# Altium schematic sheet Power_Management.SchDoc
size A4; SheetNumber: 4; SheetTotal: 7
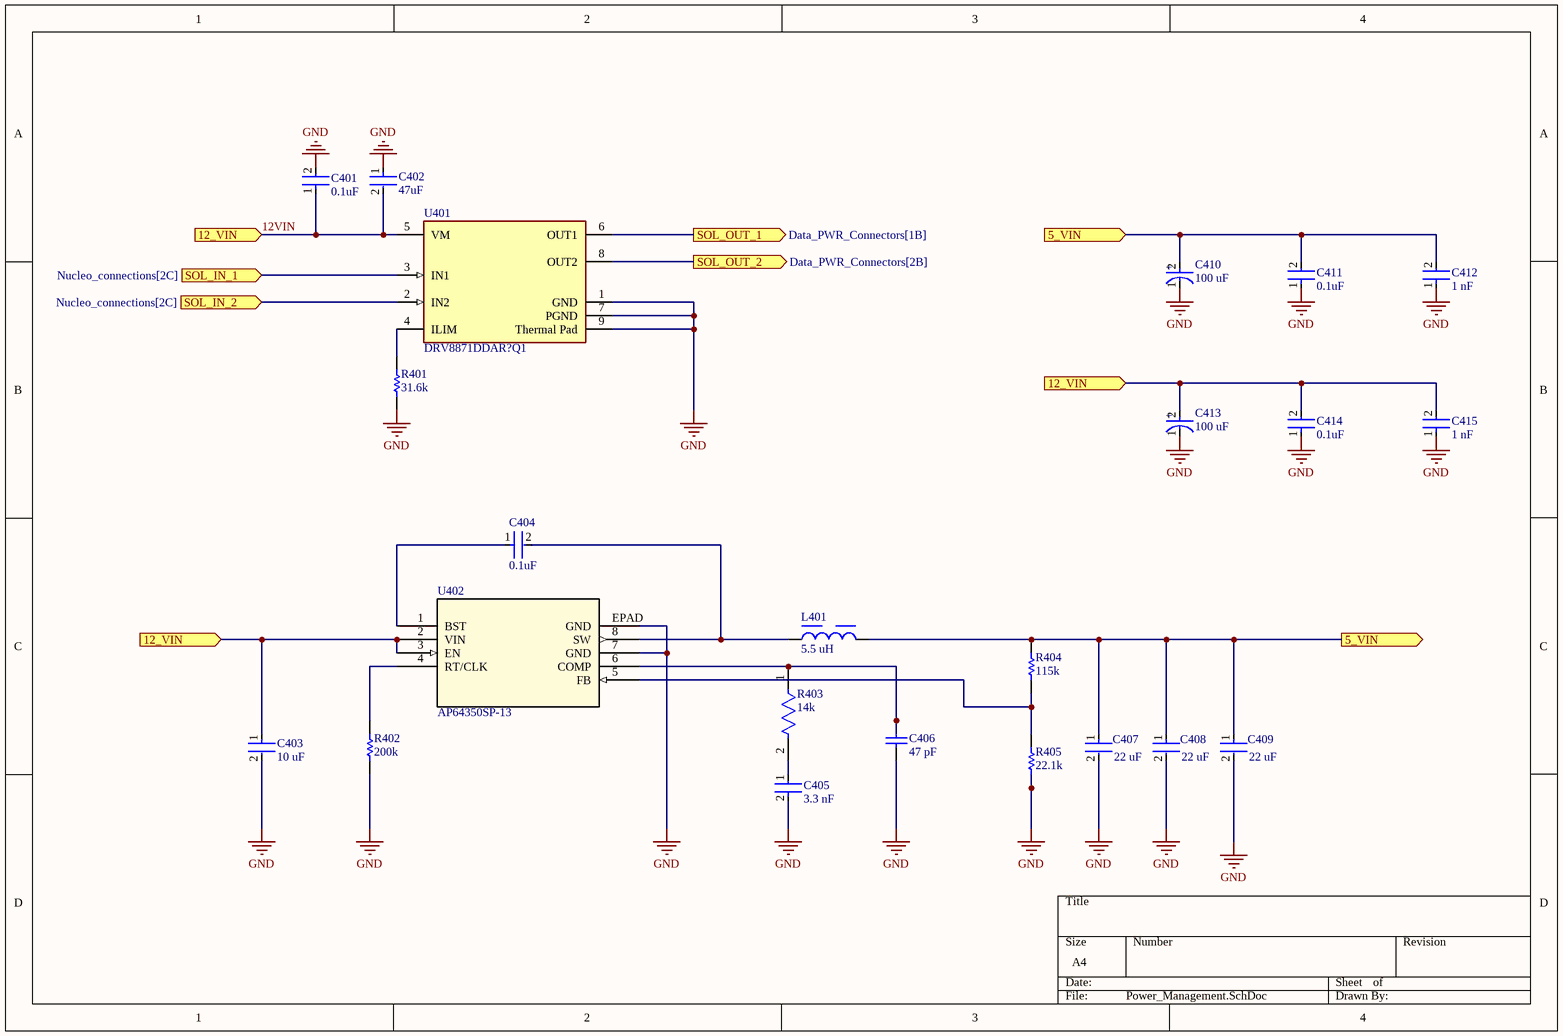
[diagram p0: Power_Management.SchDoc]

## Parts
C401  0.1uF  [FP-0805-L_2_01_0_2-W_1_25-IPC_B]
C402  47uF  [FP-C0805C476M9PACTU-MFG]
C403  10 uF  [FP-GRM21B-0_1-IPC_C]
C404  0.1uF  [FP-0805-L_2_01_0_2-W_1_25-IPC_B]
C405  3.3 nF  [FP-GRM216-0_1-IPC_B]
C406  47 pF  [CAPC2013X135X50NL15T20]
C407  22 uF  [FP-GRM21B-0_15-MFG]
C408  22 uF  [FP-GRM21B-0_15-MFG]
C409  22 uF  [FP-GRM21B-0_15-MFG]
C410  100 uF  [FP-RAD-TH-D_6_3_0_5-L_11-MFG]
C411  0.1uF  [FP-0805-L_2_01_0_2-W_1_25-IPC_B]
C412  1 nF  [FP-0805-L_2_01_0_2-W_1_25-IPC_C]
C413  100 uF  [FP-RAD-TH-D_6_3_0_5-L_11-MFG]
C414  0.1uF  [FP-0805-L_2_01_0_2-W_1_25-IPC_B]
C415  1 nF  [FP-0805-L_2_01_0_2-W_1_25-IPC_C]
L401  5.5 uH  [WE-HCI_1050]
R401  31.6k  [RESC2013X70X40LL20T20]
R402  200k  [RESC2013X70X40LL20T20]
R403  14k  [FP-CRCW0805-e3-MFG]
R404  115k  [RESC2013X50X30LL20T20]
R405  22.1k  [RESC2013X70X40NL20T20]
U401  DRV8871DDAR?Q1  [FP-DDA0008E-IPC_B]
U402  AP64350SP-13  [SO-8EP_DIO]

## Ports
5_VIN (in, see General_Tranceivers[2B], Nucleo_connections[2A], Power_Management[4C], SERVO_CAN[1B]), 5_VIN (out, see General_Tranceivers[2B], Nucleo_connections[2A], Power_Management[3A], SERVO_CAN[1B]), 12_VIN (in, see Data_PWR_Connectors[1B], Data_PWR_Connectors[4B], Power_Management[1A], Power_Management[1C], Protection_Circuit[4B], Switching_Circuits[3B], Switching_Circuits[3C], Switching_Circuits[6B], Switching_Circuits[6C]), 12_VIN (in, see Data_PWR_Connectors[1B], Data_PWR_Connectors[4B], Power_Management[1A], Power_Management[3B], Protection_Circuit[4B], Switching_Circuits[3B], Switching_Circuits[3C], Switching_Circuits[6B], Switching_Circuits[6C]), 12_VIN (in, see Data_PWR_Connectors[1B], Data_PWR_Connectors[4B], Power_Management[1C], Power_Management[3B], Protection_Circuit[4B], Switching_Circuits[3B], Switching_Circuits[3C], Switching_Circuits[6B], Switching_Circuits[6C]), SOL_IN_1 (in, see Nucleo_connections[2C]), SOL_IN_2 (in, see Nucleo_connections[2C]), SOL_OUT_1 (out, see Data_PWR_Connectors[1B]), SOL_OUT_2 (out, see Data_PWR_Connectors[2B])

## Nets
GND: C401.2 C402.1 C403.2 C405.2 C406.1 C407.2 C408.2 C409.2 C410.1(C) C411.1 C412.1 C413.1(C) C414.1 C415.1 R401.1 R402.1 R405.1 U401.1(GND) U401.7(PGND) U401.9(Thermal_Pad) U402.7(GND) U402.EPAD(GND)
5_VIN: C407.1 C408.1 C409.1 C410.2(A) C411.2 C412.2 L401.2 R404.2 ; port 5_VIN
12VIN: C401.1 C402.2 C403.1 C413.2(A) C414.2 C415.2 U401.5(VM) U402.2(VIN) U402.3(EN) ; port 12_VIN
SOL_IN_1: U401.3(IN1) ; port SOL_IN_1
SOL_IN_2: U401.2(IN2) ; port SOL_IN_2
SOL_OUT_1: U401.6(OUT1) ; port SOL_OUT_1
SOL_OUT_2: U401.8(OUT2) ; port SOL_OUT_2
NetC404_1: C404.1 U402.1(BST)
NetC404_2: C404.2 L401.1 U402.8(SW)
NetC405_1: C405.1 R403.2
NetC406_2: C406.2 R403.1 U402.6(COMP)
NetR401_2: R401.2 U401.4(ILIM)
NetR402_2: R402.2 U402.4(RT/CLK)
NetR404_1: R404.1 R405.2 U402.5(FB)

## Notes on the sheet
- (in symbol CMP-05427-000897-1) +

## Library data of the parts
C401 C404 C411 C414 = CMP-2007-04172-2: Automotive Ceramic Capacitor, 0805, 100nF, 10%, X7R, 15%, 100V; Voltage Rating (DC): 100V; Case Code (Metric): 2012; Mount: Surface Mount; Length: 2.01mm; Depth: 1.25mm; Lead Free: Lead Free; Ratings: AEC-Q200; Max Operating Temperature: 125°C; Tolerance: 10%; Case/Package: 0805; Width: 0.049inch; Package Quantity: 1; Thickness: 0.055inch; Construction: Flat; Min Operating Temperature: -55°C; REACH SVHC: No SVHC; Number of Pins: 2; Radiation Hardening: No; Capacitance: 100nF; Voltage Rating: 100V; Height: 1.4mm; Series: -; Voltage: 100V; Dielectric: X7R; Termination: SMD/SMT; Case Code (Imperial): 0805; RoHS Compliant: Yes; Packaging: Tape and Reel; Dielectric Material: Ceramic
C402 = CMP-2007-01008-2: CAP CER 47UF 6.3V X5R 0805; Dielectric Material: Ceramic; Dissipation Factor: 5%; Tolerance: 20%; Case Code (Imperial): 0805; Mount: PCB; Width: 1.2mm; Package Quantity: 3000; Radiation Hardening: No; Packaging: Tape and Reel; Termination: SMD/SMT; Series: C0805C; Voltage: 6.3V; Depth: 1.25mm; Dielectric: X5R; Case Code (Metric): 2012; Length: 2mm; Case/Package: 0805; REACH SVHC: No SVHC; Voltage Rating (DC): 6.3V; Capacitance: 47uF; RoHS Compliant: Yes; Height: 1.25mm; Construction: Flat; Number of Pins: 2; Voltage Rating: 6.3V; Max Operating Temperature: 85°C; Min Operating Temperature: -55°C
C403 = CMP-2007-03453-2: Chip Multilayer Ceramic Capacitors for General Purpose, 0805, 10uF, X5R, 15%, 10%, 16V; Radiation Hardening: No; Thickness: 0.053inch; Voltage Rating (DC): 16V; Lead Free: Lead Free; Package Quantity: 1; Width: 1.25mm; Case Code (Imperial): 0805; Depth: 1.25mm; Packaging: Tape and Reel; Dielectric: X5R; Max Operating Temperature: 85°C; Tolerance: 10%; Voltage Rating: 16V; Voltage: 16V; Capacitance: 10uF; Height: 1.25mm; Case Code (Metric): 2012; Material: Ceramic; Mount: Surface Mount; Case/Package: 0805; REACH SVHC: No SVHC; Length: 2mm; Min Operating Temperature: -55°C; Termination: SMD/SMT
C405 = CMP-2007-00889-2: Chip Multilayer Ceramic Capacitors for General Purpose, 0805, 3300pF, C0G, 30ppm/°C, 5%, 50V; Insulation Resistance: 10GR; Capacitance: 3.3nF; Mount: Surface Mount; Case/Package: 0805; Case Code (Imperial): 0805; Lead Free: Lead Free; RoHS Compliant: Yes; Dielectric: C0G; Material: Ceramic; Size: 0.6mm; Voltage Rating (DC): 50V; Voltage: 50V; Termination: SMD/SMT; Case Code (Metric): 2012; Construction: Flat; Max Operating Temperature: 125°C; Series: GRM; Min Operating Temperature: -55°C; Temperature Coefficient: 30ppm/°C; Packaging: Tape and Reel; Height: 0.6mm; REACH SVHC: No SVHC; Width: 0.049inch; Length: 2mm; Thickness: 0.028inch; Voltage Rating: 50V; Tolerance: 5%; Number of Pins: 2; Package Quantity: 1; Dielectric Material: Ceramic; Depth: 1.25mm
C406 = CMP-1036-01617-2: Part Number: VJ0805A470JXACW1BC; Manufacturer: Vitramon
C407-C409 = CMP-2007-03385-2: Chip Multilayer Ceramic Capacitors for General Purpose, 0805, 22uF, X5R, 15%, 20%, 6.3V; Material: Ceramic; Max Operating Temperature: 85°C; Voltage: 6.3V; Min Operating Temperature: -55°C; Case/Package: 0805; Thickness: 0.053inch; Dielectric: X5R; Packaging: Tape and Reel; Depth: 1.25mm; Termination: SMD/SMT; Voltage Rating (DC): 6.3V; Radiation Hardening: No; Tolerance: 20%; Mount: Surface Mount; Lead Free: Lead Free; Package Quantity: 1; REACH SVHC: No SVHC; Voltage Rating: 6.3V; Capacitance: 22uF; Length: 2mm; Case Code (Imperial): 0805; Case Code (Metric): 2012; Width: 0.049inch; Height: 1.25mm
C410 C413 = CMP-05427-000897-1: Aluminum Electrolytic Capacitors (Radial Lead Type) 100uF ±20% 25V; ESR (Equivalent Series Resistance): 130mR; Ripple Current: 455mA; Polarity: Polar; Life (Hours): 2000Hour; Lead Diameter: 0.5mm; Tolerance: 20%; Radiation Hardening: No; Min Operating Temperature: -40°C; Series: FR; Max Operating Temperature: 105°C; Lead Free: Lead Free; Package Quantity: 2000; Capacitance: 100uF; Lead Pitch: 5mm; Voltage Rating (DC): 25V; Length: 11.2mm; Features: General Purpose; Mount: Through Hole; Voltage Rating: 25V; Case/Package: Radial; Impedance: 130mR; RoHS Compliant: Yes; Packaging: Tape and Reel; Height - Seated (Max): 0.441inch; Height: 11.2mm; Diameter: 6.3mm; Termination: Radial
C412 C415 = CMP-1036-02979-3: General Purpose Ceramic Capacitor, 0805, 1nF, 10%, X7R, 0.15, 50V; Dissipation Factor: 2.5%; Insulation Resistance: 100GR; Radiation Hardening: No; Case Code (Imperial): 0805; Packaging: Tape and Reel; Height: 0.94mm; Number of Pins: 2; REACH SVHC: No SVHC; Case Code (Metric): 2012; Voltage: 50V; Max Operating Temperature: 125°C; Tolerance: 10%; Voltage Rating: 50V; Depth: 1.25mm; Voltage Rating (DC): 50V; Thickness: 0.037inch; Termination: SMD/SMT; Package Quantity: 1; RoHS Compliant: Yes; Mount: Surface Mount; Dielectric: X7R; Length: 2.01mm; Contact Plating: Tin; Lead Free: Lead Free; Case/Package: 0805; Width: 1.25mm; Capacitance: 1nF; Dielectric Material: Ceramic; Min Operating Temperature: -55°C
L401 = CMP-0226-00138-2: NexarPartId: 7866439; Shielding: Shielded; Series Resistance: 10.3Ω; Inductance: 5.5µH; Inductance Tolerance: 20%; Current Rating: 10A; DC Resistance (DCR): 10.3mΩ; Self Resonant Frequency: 30MHz; Saturation Current: 12A; Test Frequency: 100kHz; Max Operating Temperature: 150°C; Case/Package: 1050; Lead Free: Lead Free; Number of Pins: 2; Ambient Temperature Range High: 100°C; Height: 4.7mm; Mount: Surface Mount; Composition: Wirewound; Ambient Temperature Range Low: -40°C; RoHS: Compliant; Length: 10.5mm; Max DC Current: 10A; RMS Current (Irms): 10A; Width: 10.2mm; Resistance: 10.3mΩ; Packaging: Cut Tape (CT); Tolerance: 20%; Height - Seated (Max): 5.0038mm; REACH SVHC: Unknown; Depth: 10.2mm; Min Operating Temperature: -40°C; Termination: SMD/SMT
R401 = CMP-2001-00125-1: Part Number: ERJ-6ENF3162V; Manufacturer: Panasonic
R402 = CMP-2001-00028-1: Manufacturer: Panasonic; Part Number: ERJ-6ENF2003V
R403 = CMP-2001-04956-2: RES Thick Film, 14kΩ, 1%, 0.125W, 100ppm/°C, 0805; Voltage Rating: 150V; Max Power Dissipation: 125mW; Resistance: 14kR; Temperature Coefficient: 100ppm/°C; Radiation Hardening: No; Number of Terminations: 2; Lead Free: Lead Free; Depth: 1.25mm; Height: 0.45mm; Case Code (Imperial): 0805; Packaging: Tape and Reel; Termination: SMD/SMT; Military Standard: Not; Length: 2mm; Working Voltage: 150V; Contact Plating: Tin; Power Rating: 125mW; Case/Package: 0805; Case Code (Metric): 2012; Weight: 0.000194oz; Features: Automotive AEC-Q200; Width: 1.25mm; Package Quantity: 10; Voltage Rating (DC): 150V; Mount: Surface Mount; Tolerance: 1%; Composition: Thick Film; Min Operating Temperature: -55°C; Max Operating Temperature: 155°C; Number of Pins: 2
R404 = CMP-2001-04921-1: Manufacturer: Vishay Dale; Part Number: CRCW0805115KFKEA
R405 = CMP-2001-00049-1: Part Number: ERJ-6ENF2212V; Manufacturer: Panasonic
U401 = CMP-04915-000036-1: IC MOTOR DRVR UNIPLR 8SO PWRPAD; Interface: PWM; Output Current: 3.6A; Logic Function: AND GATE; Max Operating Temperature: 125°C; Packaging: Rail/Tube; Lead Free: Lead Free; Mount: Surface Mount; RoHS Compliant: Yes; Number of Pins: 8; Min Operating Temperature: -40°C
U402 = AP64350SP-13: No Description Available; Mfr_Name: Diodes Inc; RefDes: RefDes; Type: Type